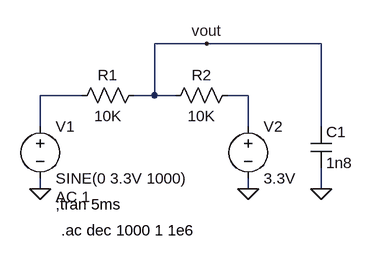
[diagram p0: schematic ADC scaling & filter.asc]
ADC scaling & filter.asc, the LTspice schematic file:
Version 4
SHEET 1 880 680
WIRE 304 32 224 32
WIRE 480 32 304 32
WIRE 112 112 48 112
WIRE 224 112 224 32
WIRE 224 112 192 112
WIRE 256 112 224 112
WIRE 368 112 336 112
WIRE 48 160 48 112
WIRE 368 160 368 112
WIRE 480 160 480 32
WIRE 48 256 48 240
WIRE 368 256 368 240
WIRE 480 256 480 224
FLAG 48 256 0
FLAG 368 256 0
FLAG 304 32 vout
FLAG 480 256 0
SYMBOL voltage 48 144 R0
WINDOW 123 24 124 Left 2
WINDOW 39 0 0 Left 2
SYMATTR Value2 AC 1
SYMATTR InstName V1
SYMATTR Value SINE(0 3.3V 1000)
SYMBOL voltage 368 144 R0
WINDOW 123 0 0 Left 2
WINDOW 39 0 0 Left 2
SYMATTR InstName V2
SYMATTR Value 3.3V
SYMBOL res 208 96 R90
WINDOW 0 0 56 VBottom 2
WINDOW 3 32 56 VTop 2
SYMATTR InstName R1
SYMATTR Value 10K
SYMBOL res 352 96 R90
WINDOW 0 0 56 VBottom 2
WINDOW 3 32 56 VTop 2
SYMATTR InstName R2
SYMATTR Value 10K
SYMBOL cap 464 160 R0
SYMATTR InstName C1
SYMATTR Value 1n8
TEXT 72 280 Left 2 !;tran 5ms
TEXT 80 320 Left 2 !.ac dec 1000 1 1e6

The netlist it stands for:
* ADC scaling & filter.asc
V1 N001 0 SINE(0 3.3V 1000) AC 1
V2 N002 0 3.3V
R1 vout N001 10K
R2 N002 vout 10K
C1 vout 0 1n8
;tran 5ms
.ac dec 1000 1 1e6
.backanno
.end